# Altium schematic sheet 1sXBusAltimeter.SchDoc
size A4
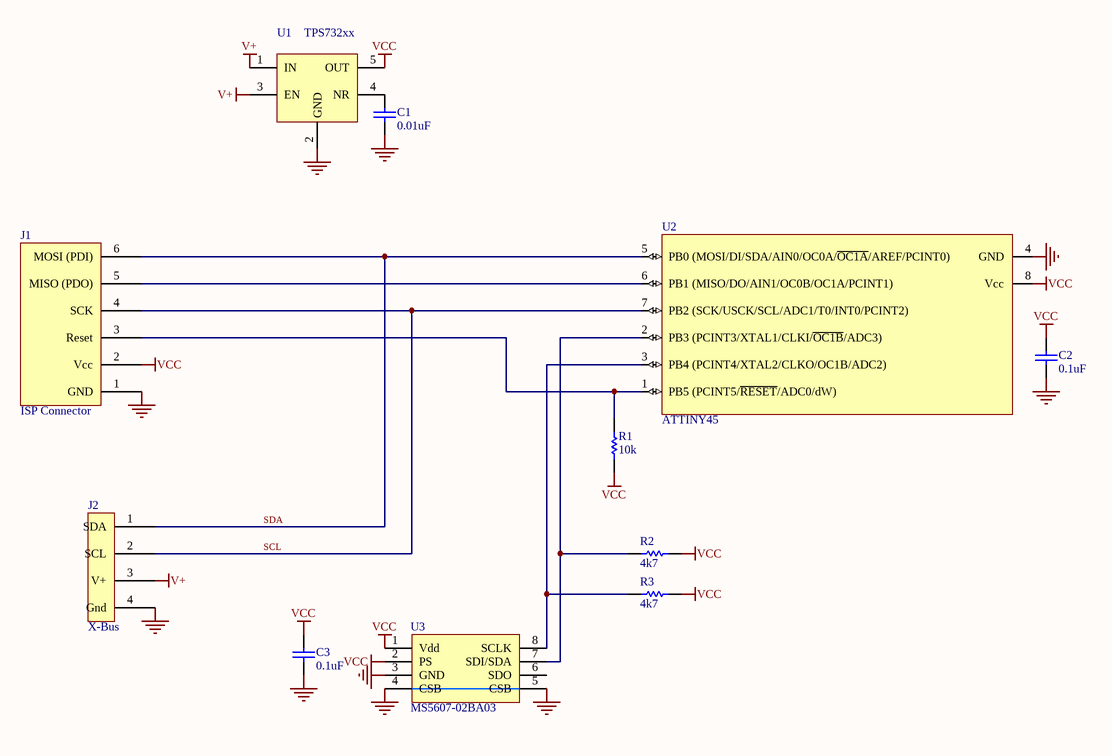
[diagram p0: 1sXBusAltimeter.SchDoc]

## Parts
C1  value 0.01uF  [Cap SMD 0603]  (hidden comment: Cap)
C2  value 0.1uF  [Cap SMD 0603]  (hidden comment: Cap)
C3  value 0.1uF  [Cap SMD 0603]  (hidden comment: Cap)
J1  ISP Connector  [HDR2X3]
J2  X-Bus  [JST-ZH S4B-ZR]
R1  value 10k  [Res SMD 0603]  (hidden comment: Res1)
R2  value 4k7  [Res SMD 0603]  (hidden comment: Res1)
R3  value 4k7  [Res SMD 0603]  (hidden comment: Res1)
U1  TPS732xx  [SOT-23-5]
U2  ATTINY45  [TSSOP8-4.4mm]
U3  MS5607-02BA03  [QFN-8]

## Nets
GND: C1.1 C2.1 C3.1 J1.1(GND) J2.4(Gnd) U1.2(GND) U2.4(GND) U3.3(GND) U3.4(CSB) U3.5(CSB)
V+: J2.3(V+) U1.1(IN) U1.3(EN)
VCC: C2.2 C3.2 J1.2(Vcc) R1.2 R2.2 R3.2 U1.5(OUT) U2.8(Vcc) U3.1(Vdd) U3.2(PS)
SCL: J1.4(SCK) J2.2(SCL) U2.7(PB2_(SCK/USCK/SCL/ADC1/T0/INT0/PCINT2))
SDA: J1.6(MOSI_(PDI)) J2.1(SDA) U2.5(PB0_(MOSI/DI/SDA/AIN0/OC0A/~{OC1A}/AREF/PCINT0))
NetC1_2: C1.2 U1.4(NR)
NetJ1_3: J1.3(Reset) R1.1 U2.1(PB5_(PCINT5/~{RESET}/ADC0/dW))
NetJ1_5: J1.5(MISO_(PDO)) U2.6(PB1_(MISO/DO/AIN1/OC0B/OC1A/PCINT1))
NetR2_1: R2.1 U2.2(PB3_(PCINT3/XTAL1/CLKI/~{OC1B}/ADC3)) U3.7(SDI/SDA)
NetR3_1: R3.1 U2.3(PB4_(PCINT4/XTAL2/CLKO/OC1B/ADC2)) U3.8(SCLK)

Not connected (* = marked no-connect by the designer): U3 6(SDO)

## Library data of the parts
C1-C3 = Cap: Capacitor; Published: 8-Jun-2000; LatestRevisionDate: 17-Jul-2002; LatestRevisionNote: Re-released for DXP Platform.; PackageReference: RAD-0.3; Publisher: Altium Limited; PackageDescription: Radial Cap, Thru-Hole; 2 Leads; 0.3 in Pin Spacing
J1 = ISP Connector: pin to pad: 1>6 3>5 4>3 5>1 6>4
J2 = SIP4 CONNECTOR
R1-R3 = Resistor
U1 = TPS732xx LDO: TPS732xx LDO Voltage Regulator
U3 = MS5607-02BA03: MS5607-02BA03 Barometer